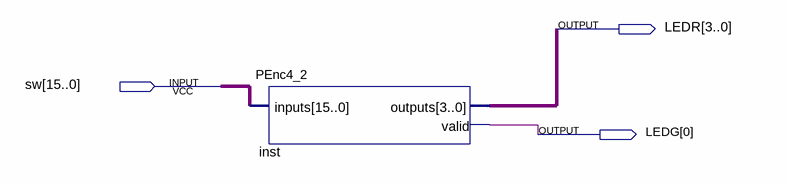
[diagram p0: schematic sheet]
// Quartus schematic PEnc4_2Demo.bdf as structural Verilog: 1 symbols, 3 pins
module PEnc4_2Demo (
  input  [15:0] sw,
  output [3:0] LEDR,
  output [0:0] LEDG
);

  PEnc4_2 inst (.inputs(sw), .outputs(LEDR), .valid(LEDG[0]));
endmodule
